# EAGLE design USB&LiPoPower (EAGLE 9.5.1)
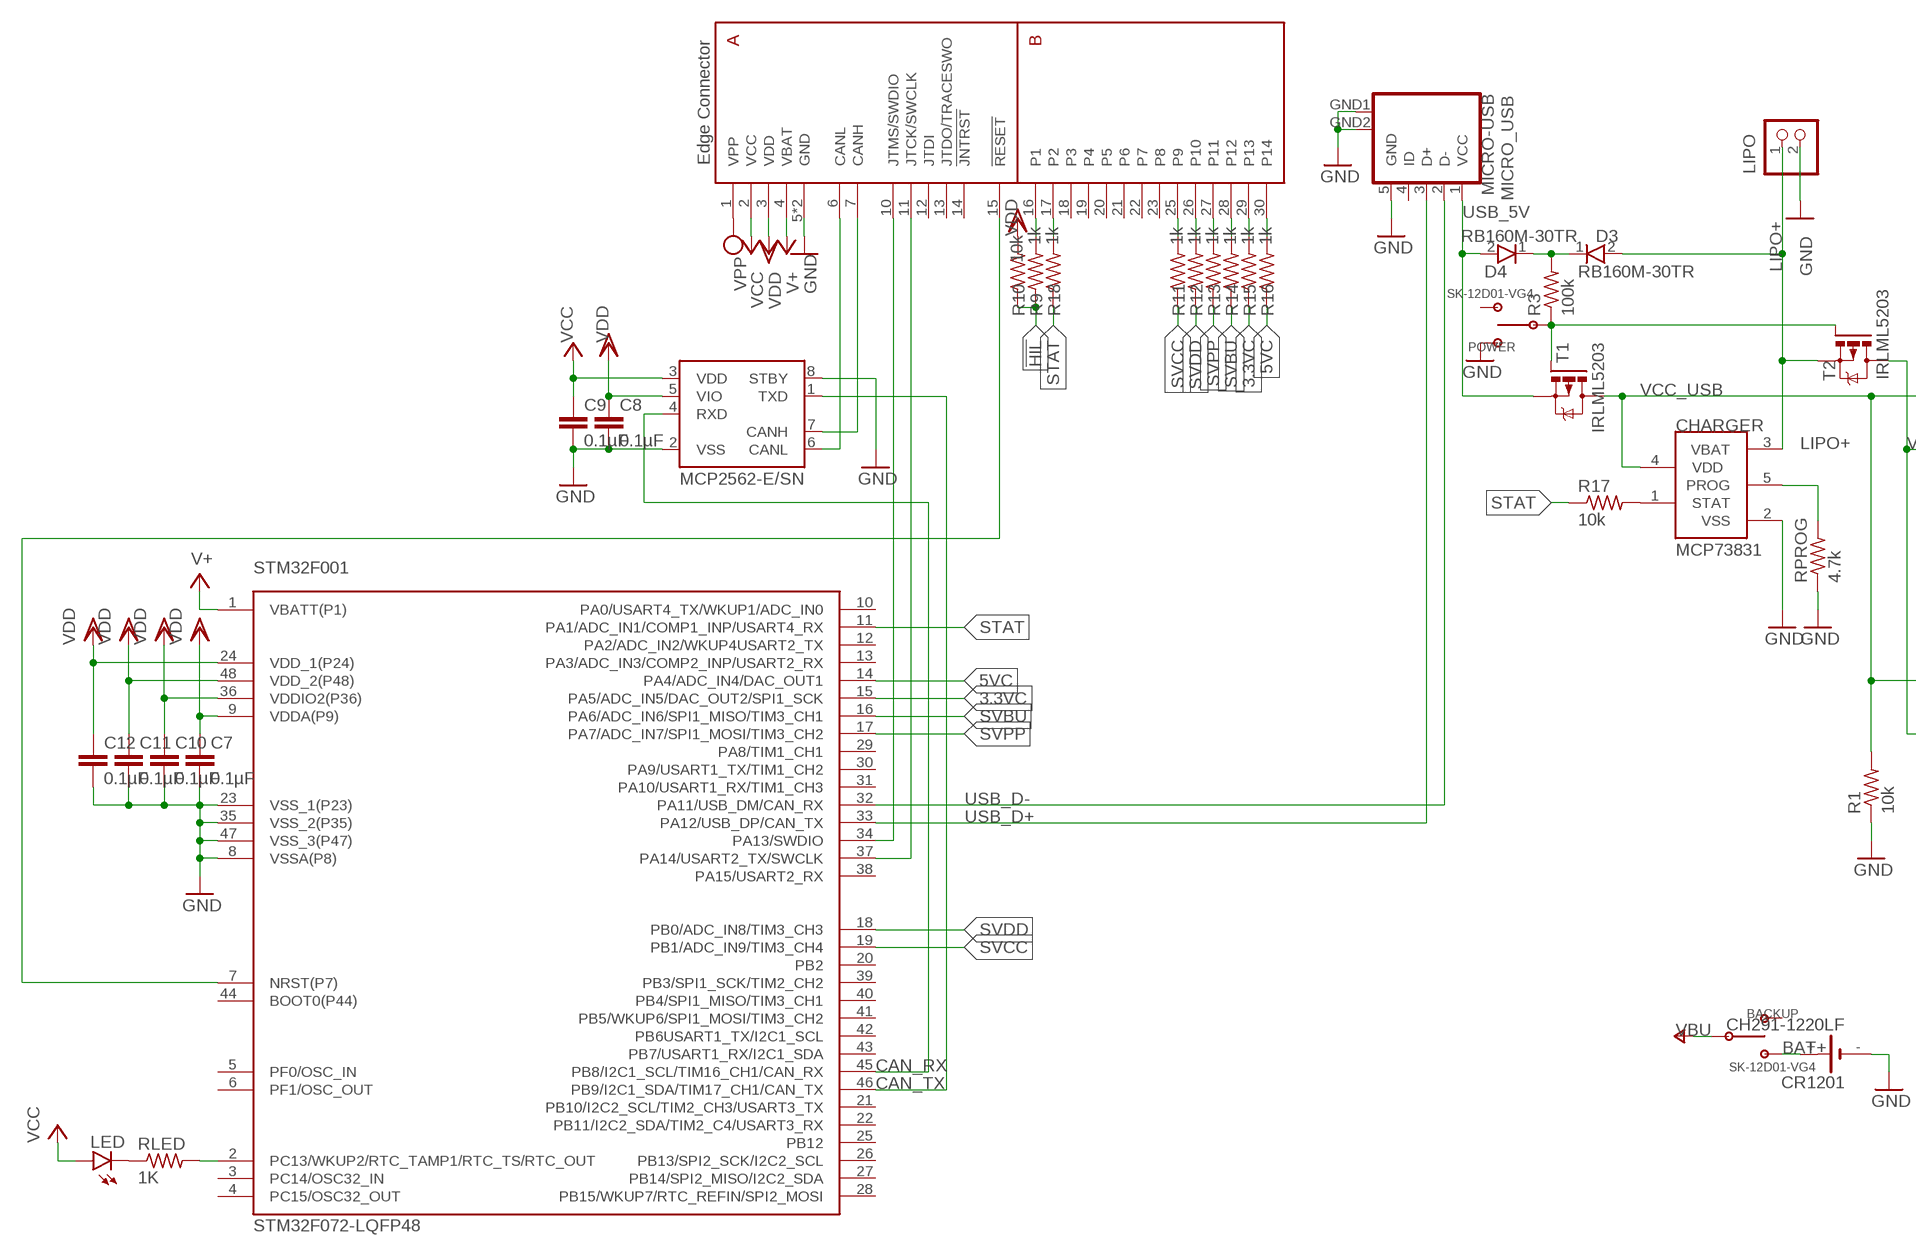
[diagram p0: schematic, sheet 1, part 1 of 2]
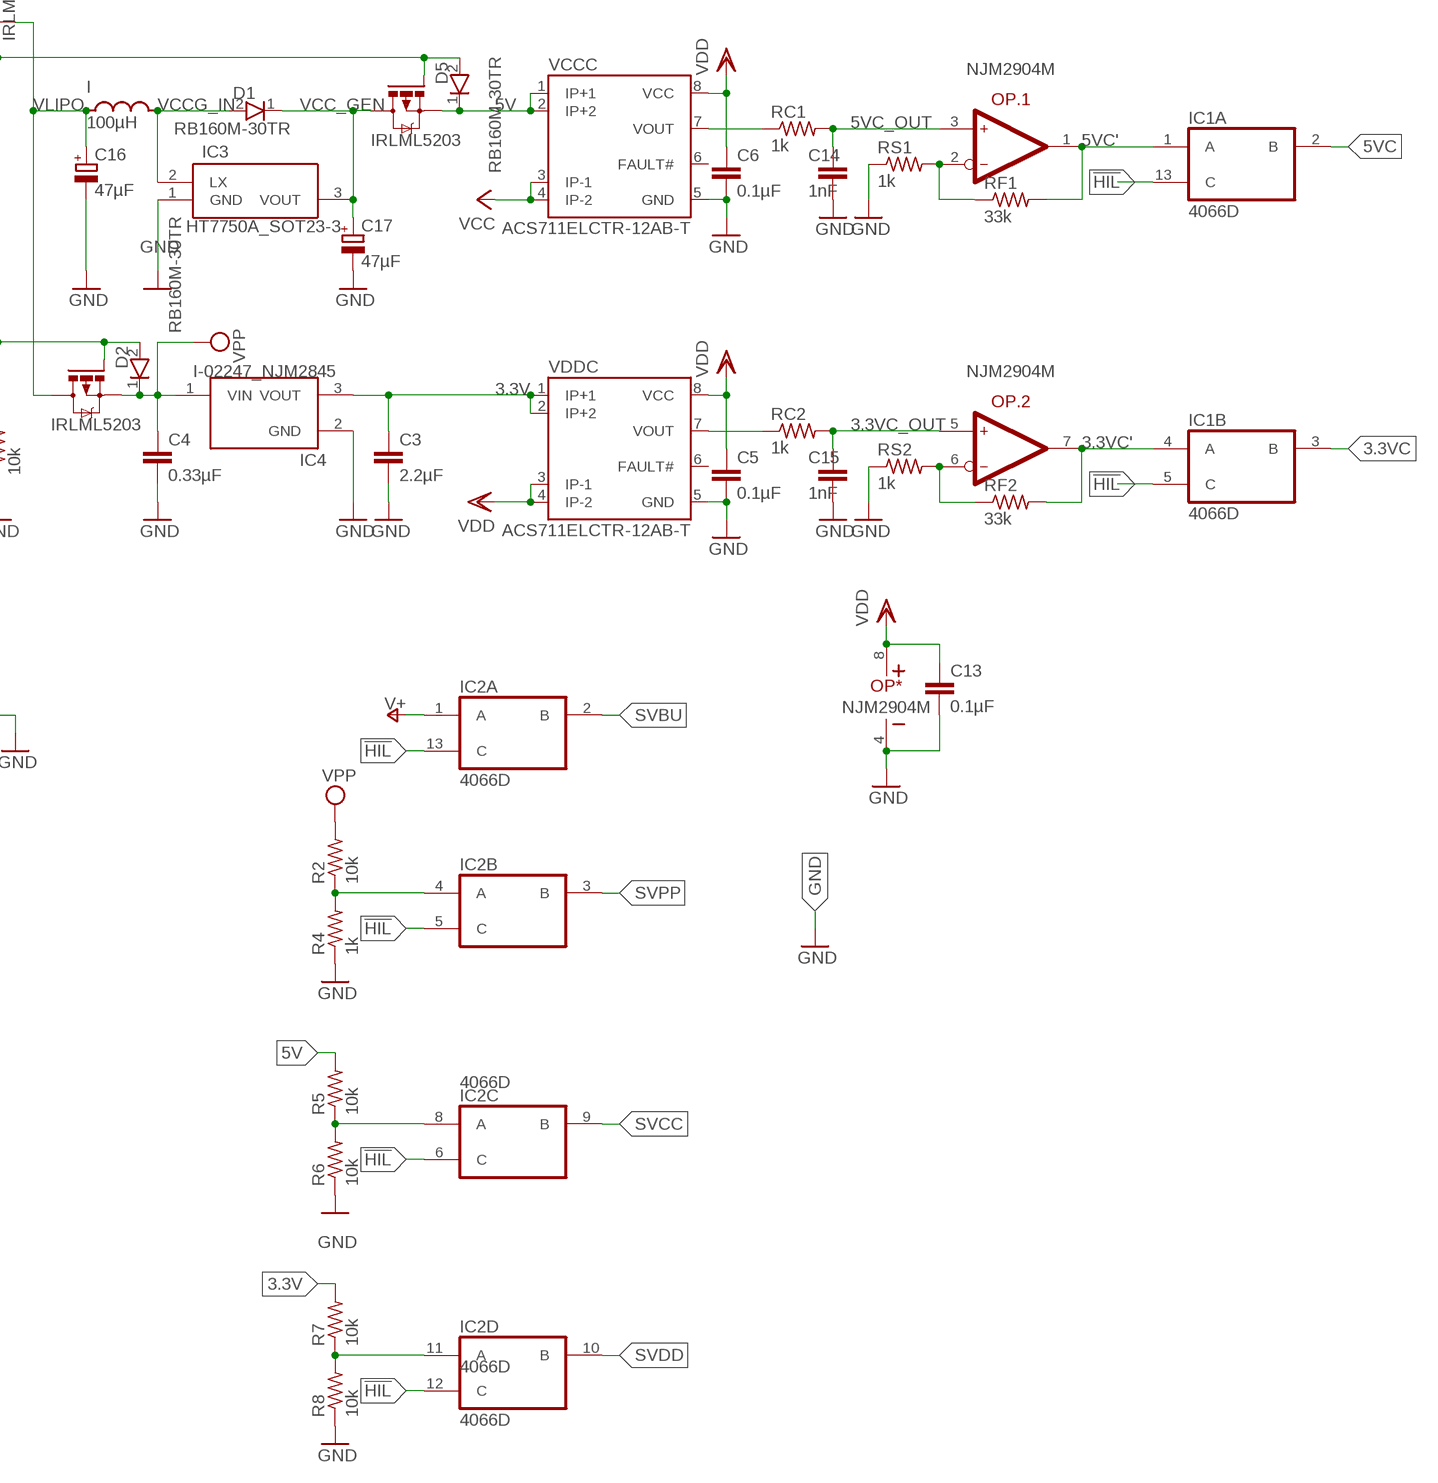
[diagram p1: schematic, sheet 1, part 2 of 2]

## Parts
BACKUP  SK-12D01-VG4  [SK-12D01-VG4]
C3  2.2µF  C-EUC0603K  [C0603K]
C4  0.33µF  C-EUC0603K  [C0603K]
C5  0.1µF  C-EUC0603K  [C0603K]
C6  0.1µF  C-EUC0603K  [C0603K]
C7  0.1µF  C-EUC0603K  [C0603K]
C8  0.1µF  C-EUC0603K  [C0603K]
C9  0.1µF  C-EUC0603K  [C0603K]
C10  0.1µF  C-EUC0603K  [C0603K]
C11  0.1µF  C-EUC0603K  [C0603K]
C12  0.1µF  C-EUC0603K  [C0603K]
C13  0.1µF  C-EUC0603K  [C0603K]
C14  1nF  C-EUC0603K  [C0603K]
C15  1nF  C-EUC0603K  [C0603K]
C16  47µF  CPOL-EUUD-5X5,8  [UD-5X5,8_NICHICON]
C17  47µF  CPOL-EUUD-5X5,8  [UD-5X5,8_NICHICON]
CHARGER  MCP73831  [SOT23-5L]
CR1201  CH291-1220LF  [CH291-1220LF]
D1  RB160M-30TR  [SODFL3516X90N]
D2  RB160M-30TR  [SODFL3516X90N]
D3  RB160M-30TR  [SODFL3516X90N]
D4  RB160M-30TR  [SODFL3516X90N]
D5  RB160M-30TR  [SODFL3516X90N]
I  100µH  NR10050  [NR10050]
IC1  4066D  [SO14]
IC2  4066D  [SO14]
IC3  HT7750A_SOT23-3  [SOT95P190X145-3N]
IC4  I-02247_NJM2845  [TO252]
LED  LEDCHIP-LED0603  [CHIP-LED0603]
LIPO  S2B-PH-K-S  [S2B-PH-K-S]
MCP2562  MCP2562-E/SN  [SOIC127P600X175-8N]
MICRO_USB  MICRO-USB  [MICRO-USB]
OP  NJM2904M  [SO-8]
POWER  SK-12D01-VG4  [SK-12D01-VG4]
R1  10k  R-US_R0603  [R0603]
R2  10k  R-US_R0603  [R0603]
R3  100k  R-US_R0603  [R0603]
R4  1k  R-US_R0603  [R0603]
R5  10k  R-US_R0603  [R0603]
R6  10k  R-US_R0603  [R0603]
R7  10k  R-US_R0603  [R0603]
R8  10k  R-US_R0603  [R0603]
R9  1k  R-US_R0603  [R0603]
R10  10k  R-US_R0603  [R0603]
R11  1k  R-US_R0603  [R0603]
R12  1k  R-US_R0603  [R0603]
R13  1k  R-US_R0603  [R0603]
R14  1k  R-US_R0603  [R0603]
R15  1k  R-US_R0603  [R0603]
R16  1k  R-US_R0603  [R0603]
R17  10k  R-US_R0603  [R0603]
R18  1k  R-US_R0603  [R0603]
RC1  1k  R-US_R0603  [R0603]
RC2  1k  R-US_R0603  [R0603]
RF1  33k  R-US_R0603  [R0603]
RF2  33k  R-US_R0603  [R0603]
RLED  1K  R-US_R0603  [R0603]
RPROG  4.7k  R-US_R0603  [R0603]
RS1  1k  R-US_R0603  [R0603]
RS2  1k  R-US_R0603  [R0603]
STM32F001  STM32F072-LQFP48  [LQFP48]
T1  IRLML5203  [MICRO3]
T2  IRLML5203  [MICRO3]
T3  IRLML5203  [MICRO3]
T4  IRLML5203  [MICRO3]
U$2  EDGE30  [EDGE30]
VCCC  ACS711ELCTR-12AB-T  [SOIC8]
VDDC  ACS711ELCTR-12AB-T  [SOIC8]

## Nets
3.3V: C3.1 IC4.3(VOUT) R7.2 VDDC.1(IP+1) VDDC.2(IP+2)
3.3VC: IC1.3(B:B) R15.1 STM32F001.15(PA5/ADC_IN5/DAC_OUT2/SPI1_SCK)
3.3VC': IC1.4(B:A) OP.7(.2:OUT) RF2.2
3.3VC_OUT: C15.1 OP.5(.2:IN+) RC2.2
3.3VC_OUT': RC2.1 VDDC.7(VOUT)
5V: D5.1(K) R5.2 T3.2(S) VCCC.1(IP+1) VCCC.2(IP+2)
5VC: IC1.2(A:B) R16.1 STM32F001.14(PA4/ADC_IN4/DAC_OUT1)
5VC': IC1.1(A:A) OP.1(.1:OUT) RF1.2
5VC_OUT: C14.1 OP.3(.1:IN+) RC1.2
5VC_OUT': RC1.1 VCCC.7(VOUT)
!HIL!: IC1.5(B:C) IC1.13(A:C) IC2.5(B:C) IC2.6(C:C) IC2.12(D:C) IC2.13(A:C) R9.1 R10.1
BAT+: BACKUP.B CR1201.+
CAN_RX: MCP2562.4(RXD) STM32F001.45(PB8/I2C1_SCL/TIM16_CH1/CAN_RX)
CAN_TX: MCP2562.1(TXD) STM32F001.46(PB9/I2C1_SDA/TIM17_CH1/CAN_TX)
CANH1: MCP2562.7(CANH) U$2.7(CANH)
CANL1: MCP2562.6(CANL) U$2.6(CANL)
GND: C3.2 C4.2 C5.2 C6.2 C7.2 C8.2 C9.2 C10.2 C11.2 C12.2 C13.2 C14.2 C15.2 C16.- C17.- CHARGER.2(VSS) CR1201.- IC3.1(GND) IC4.2(GND) LIPO.2 MCP2562.2(VSS) MCP2562.8(STBY) MICRO_USB.5(GND) MICRO_USB.GND1(GND) MICRO_USB.GND2(GND) OP.4(*:V-) POWER.A R1.1 R4.1 R6.1 R8.1 RPROG.1 RS1.1 RS2.1 STM32F001.8(VSSA(P8)) STM32F001.23(VSS_1(P23)) STM32F001.35(VSS_2(P35)) STM32F001.47(VSS_3(P47)) U$2.5(GND) U$2.8(GND) VCCC.5(GND) VDDC.5(GND)
LIPO+: CHARGER.3(VBAT) D3.2(A) LIPO.1 T2.2(S)
N$1: CHARGER.5(PROG) RPROG.2
N$2: CHARGER.1(STAT) R17.2
N$3: LED.C RLED.1
N$5: OP.2(.1:IN-) RF1.1 RS1.2
N$6: OP.6(.2:IN-) RF2.1 RS2.2
N$9: POWER.C R3.1 T1.1(G) T2.1(G)
N$10: D3.1(K) D4.1(K) R3.2
N$33: R16.2 U$2.30(P14)
N$34: R15.2 U$2.29(P13)
N$35: R14.2 U$2.28(P12)
N$36: R13.2 U$2.27(P11)
N$43: R12.2 U$2.26(P10)
N$44: R11.2 U$2.25(P9)
N$73: RLED.2 STM32F001.2(PC13/WKUP2/RTC_TAMP1/RTC_TS/RTC_OUT)
N$74: R9.2 U$2.16(P1)
N$75: R18.2 U$2.17(P2)
NRST1: STM32F001.7(NRST(P7)) U$2.15(!RESET!)
PVCC: IC2.8(C:A) R5.1 R6.2
PVDD: IC2.11(D:A) R7.1 R8.2
PVPP: IC2.4(B:A) R2.1 R4.2
STAT: R17.1 R18.1 STM32F001.11(PA1/ADC_IN1/COMP1_INP/USART4_RX)
SVBU: IC2.2(A:B) R14.1 STM32F001.16(PA6/ADC_IN6/SPI1_MISO/TIM3_CH1)
SVCC: IC2.9(C:B) R11.1 STM32F001.19(PB1/ADC_IN9/TIM3_CH4)
SVDD: IC2.10(D:B) R12.1 STM32F001.18(PB0/ADC_IN8/TIM3_CH3)
SVPP: IC2.3(B:B) R13.1 STM32F001.17(PA7/ADC_IN7/SPI1_MOSI/TIM3_CH2)
SWCLK1: STM32F001.37(PA14/USART2_TX/SWCLK) U$2.11(JTCK/SWCLK)
SWDIO1: STM32F001.34(PA13/SWDIO) U$2.10(JTMS/SWDIO)
USB_5V: D4.2(A) MICRO_USB.1(VCC) T1.2(S)
USB_D+: MICRO_USB.3(D+) STM32F001.33(PA12/USB_DP/CAN_TX)
USB_D-: MICRO_USB.2(D-) STM32F001.32(PA11/USB_DM/CAN_RX)
VBU: BACKUP.C IC2.1(A:A) STM32F001.1(VBATT(P1)) U$2.4(VBAT) ; supply symbol labelled V+
VCC: C9.1 LED.A MCP2562.3(VDD) U$2.2(VCC) VCCC.3(IP-1) VCCC.4(IP-2)
VCC_GEN: C17.+ D1.1(K) IC3.3(VOUT) T3.3(D)
VCC_USB: CHARGER.4(VDD) D2.2(A) D5.2(A) R1.2 T1.3(D) T3.1(G) T4.1(G)
VCCG_IN: D1.2(A) I.2 IC3.2(LX)
VDD: C5.1 C6.1 C7.1 C8.1 C10.1 C11.1 C12.1 C13.1 MCP2562.5(VIO) OP.8(*:V+) R10.2 STM32F001.9(VDDA(P9)) STM32F001.24(VDD_1(P24)) STM32F001.36(VDDIO2(P36)) STM32F001.48(VDD_2(P48)) U$2.3(VDD) VCCC.8(VCC) VDDC.3(IP-1) VDDC.4(IP-2) VDDC.8(VCC)
VLIPO: C16.+ I.1 T2.3(D) T4.3(D)
VPP: C4.1 D2.1(K) IC4.1(VIN) R2.2 T4.2(S) U$2.1(VPP)
Unconnected: BACKUP.A IC1.6(C:C) IC1.8(C:A) IC1.9(C:B) IC1.10(D:B) IC1.11(D:A) IC1.12(D:C) MICRO_USB.4(ID) POWER.B STM32F001.3(PC14/OSC32_IN) STM32F001.4(PC15/OSC32_OUT) STM32F001.5(PF0/OSC_IN) STM32F001.6(PF1/OSC_OUT) STM32F001.10(PA0/USART4_TX/WKUP1/ADC_IN0) STM32F001.12(PA2/ADC_IN2/WKUP4USART2_TX) STM32F001.13(PA3/ADC_IN3/COMP2_INP/USART2_RX) STM32F001.20(PB2) STM32F001.21(PB10/I2C2_SCL/TIM2_CH3/USART3_TX) STM32F001.22(PB11/I2C2_SDA/TIM2_C4/USART3_RX) STM32F001.25(PB12) STM32F001.26(PB13/SPI2_SCK/I2C2_SCL) STM32F001.27(PB14/SPI2_MISO/I2C2_SDA) STM32F001.28(PB15/WKUP7/RTC_REFIN/SPI2_MOSI) STM32F001.29(PA8/TIM1_CH1) STM32F001.30(PA9/USART1_TX/TIM1_CH2) STM32F001.31(PA10/USART1_RX/TIM1_CH3) STM32F001.38(PA15/USART2_RX) STM32F001.39(PB3/SPI1_SCK/TIM2_CH2) STM32F001.40(PB4/SPI1_MISO/TIM3_CH1) STM32F001.41(PB5/WKUP6/SPI1_MOSI/TIM3_CH2) STM32F001.42(PB6USART1_TX/I2C1_SCL) STM32F001.43(PB7/USART1_RX/I2C1_SDA) STM32F001.44(BOOT0(P44)) U$2.12(JTDI) U$2.13(JTDO/TRACESWO) U$2.14(!JNTRST!) U$2.18(P3) U$2.19(P4) U$2.20(P5) U$2.21(P6) U$2.22(P7) U$2.23(P8) VCCC.6(FAULT#) VDDC.6(FAULT#)

## Power pins joined to a net without a drawn wire
GND: IC1.7(P:VSS) IC2.7(P:VSS)
VDD: IC1.14(P:VDD) IC2.14(P:VDD)

## Library data of the parts
BACKUP POWER = switches:SK-12D01-VG4
C3-C15 = rcl:C-EU: CAPACITOR, European symbol; SPICEPREFIX: C
C16 C17 = rcl:CPOL-EU: POLARIZED CAPACITOR, European symbol; SPICEPREFIX: C
CHARGER = mcp73831:MCP73831: Miniature Single-Cell, Fully Integrated Li-Ion, Li-Polymer Charge Management Controllers
CR1201 = battery:CH291-1220LF: Battery Holder, SMT, 12mm multicomp PART NO. CH291-1220LF Source: Data sheet <http://www.farnell.com/datasheets/1505860.pdf>
D1-D5 = RB160M-30TR:RB160M-30TR: ROHM - RB160M-30TR - DIODE, SCHOTTKY, PMDS Source: Datasheet <https://componentsearchengine.com/Datasheets/2/RB160M-30TR.pdf>; DESCRIPTION: ROHM - RB160M-30TR - DIODE, SCHOTTKY, PMDS; HEIGHT: 0.9mm; MANUFACTURER_NAME: ROHM Semiconductor; MANUFACTURER_PART_NUMBER: RB160M-30TR; MOUSER_PART_NUMBER: 755-RB160M-30TR; MOUSER_PRICE-STOCK: https://www.mouser.com/Search/Refine.aspx?Keyword=755-RB160M-30TR; RS_PART_NUMBER: 7526079; RS_PRICE-STOCK: https://uk.rs-online.com/web/p/products/7526079
I = nr10050:NR10050
IC1 IC2 = 40xx:4066: Quad bilateral ANALOG SWITCH
IC3 = HT7750A_SOT23-3:HT7750A_SOT23-3: PFM Step-up DC/DC Converter Source: Datasheet <http://www.holtek.com.tw/documents/10179/11842/HT77xxAv140.pdf#search='HT7750A SOT23'>; DESCRIPTION: PFM Step-up DC/DC Converter; HEIGHT: 1.45mm; MANUFACTURER_NAME: Holtek; MANUFACTURER_PART_NUMBER: HT7750A SOT23-3
IC4 = akizuki:I-02247_NJM2845
LED = led:LED: LED OSRAM: - CHIPLED LG R971, LG N971, LY N971, LG Q971, LY Q971, LO R971, LY R971 LH N974, LH R974 LS Q976, LO Q976, LY Q976 LO Q996 - Hyper CHIPLED LW Q18S LB Q993, LB Q99A, LB R99A - SideLED LS A670, LO A670, LY A670, LG A670, LP A670 LB A673, LV A673, LT A673, LW A673 LH A674 LY A675 LS A676, LA A676, LO A676, LY A676, LW A676 LS A679, LY A679, LG A679 - Hyper Micro SIDELED® LS Y876, LA Y876, LO Y876, LY Y876 LT Y87S - SmartLED LW L88C, LW L88S LB L89C, LB L89S, LG L890 LS L89K, LO L89K, LY L89K LS L896, LA L896, LO L896, LY L896 - TOPLED LS T670, LO T670, LY T670, LG T670, LP T670 LSG T670, LSP T670, LSY T670, LOP T670, LYG T670 LG T671, LOG T671, LSG T671 LB T673, LV T673, LT T673, LW T673 LH T674 LS T676, LA T676, LO T676, LY T676, LB T676, LH T676, LSB T676, LW T676 LB T67C, LV T67C, LT T67C, LS T67K, LO T67K, LY T67K, LW E67C LS E67B, LA E67B, LO E67B, LY E67B, LB E67C, LV E67C, LT E67C LW T67C LS T679, LY T679, LG T679 LS T770, LO T770, LY T770, LG T770, LP T770 LB T773, LV T773, LT T773, LW T773 LH T774 LS E675, LA E675, LY E675, LS T675 LS T776, LA T776, LO T776, LY T776, LB T776 LHGB T686 LT T68C, LB T68C - Hyper Mini TOPLED® LB M676 - Mini TOPLED Santana® LG M470 LS M47K, LO M47K, LY M47K Source: http://www.osram.convergy.de LUXEON: - LUMILED® LXK2-PW12-R00, LXK2-PW12-S00, LXK2-PW14-U00, LXK2-PW14-V00 LXK2-PM12-R00, LXK2-PM12-S00, LXK2-PM14-U00 LXK2-PE12-Q00, LXK2-PE12-R00, LXK2-PE12-S00, LXK2-PE14-T00, LXK2-PE14-U00 LXK2-PB12-K00, LXK2-PB12-L00, LXK2-PB12-M00, LXK2-PB14-N00, LXK2-PB14-P00, LXK2-PB14-Q00 LXK2-PR12-L00, LXK2-PR12-M00, LXK2-PR14-Q00, LXK2-PR14-R00 LXK2-PD12-Q00, LXK2-PD12-R00, LXK2-PD12-S00 LXK2-PH12-R00, LXK2-PH12-S00 LXK2-PL12-P00, LXK2-PL12-Q00, LXK2-PL12-R00 Source: www.luxeon.com KINGBRIGHT: KA-3528ASYC Source: www.kingbright.com
LIPO = jst-ph:S2B-PH-*: Wire-to-Board 2.0mm pitch side mount connector Source: http://www.jst-mfg.com/product/pdf/jpn/PH.pdf http://www.jst-mfg.com/product/detail.php?series=199
MCP2562 = mcp2562-E_SN:MCP2562-E/SN: MCP2562 Series 5 V Surface Mount High-Speed CAN Transceiver - SOIC-8; AVAILABILITY: Unavailable; DESCRIPTION: Microchip MCP2562-E/SN, CAN Transceiver 1MBps 1-channel IEC 61000-4-2, 8-Pin SOIC; MF: Microchip; MP: MCP2562-E/SN; PACKAGE: SO-8 Microchip; PRICE: None
MICRO_USB = microusb2:MICRO-USB: Micro USB B connector
OP = ic-jrc:NJM2904; MOUSER: 513-NJM2904M
R1-R8 RC1 RC2 RF1 RF2 RLED RPROG RS1 RS2 = rcl:R-US_: RESISTOR, American symbol; SPICEPREFIX: R
R9-R18 = resistor:R-US_: RESISTOR, American symbol
STM32F001 = stm32f0:STM32F072
T1-T4 = transistor-power:IRLML5203: HEXFET P-Channel Power MOSFET
U$2 = bus:EDGE30
VCCC VDDC = allegro:ACS711E: SENSOR CURRENT 3.3V 8-SOIC tested: YES (etherbotix); CURRENT: 12.5A

## Board
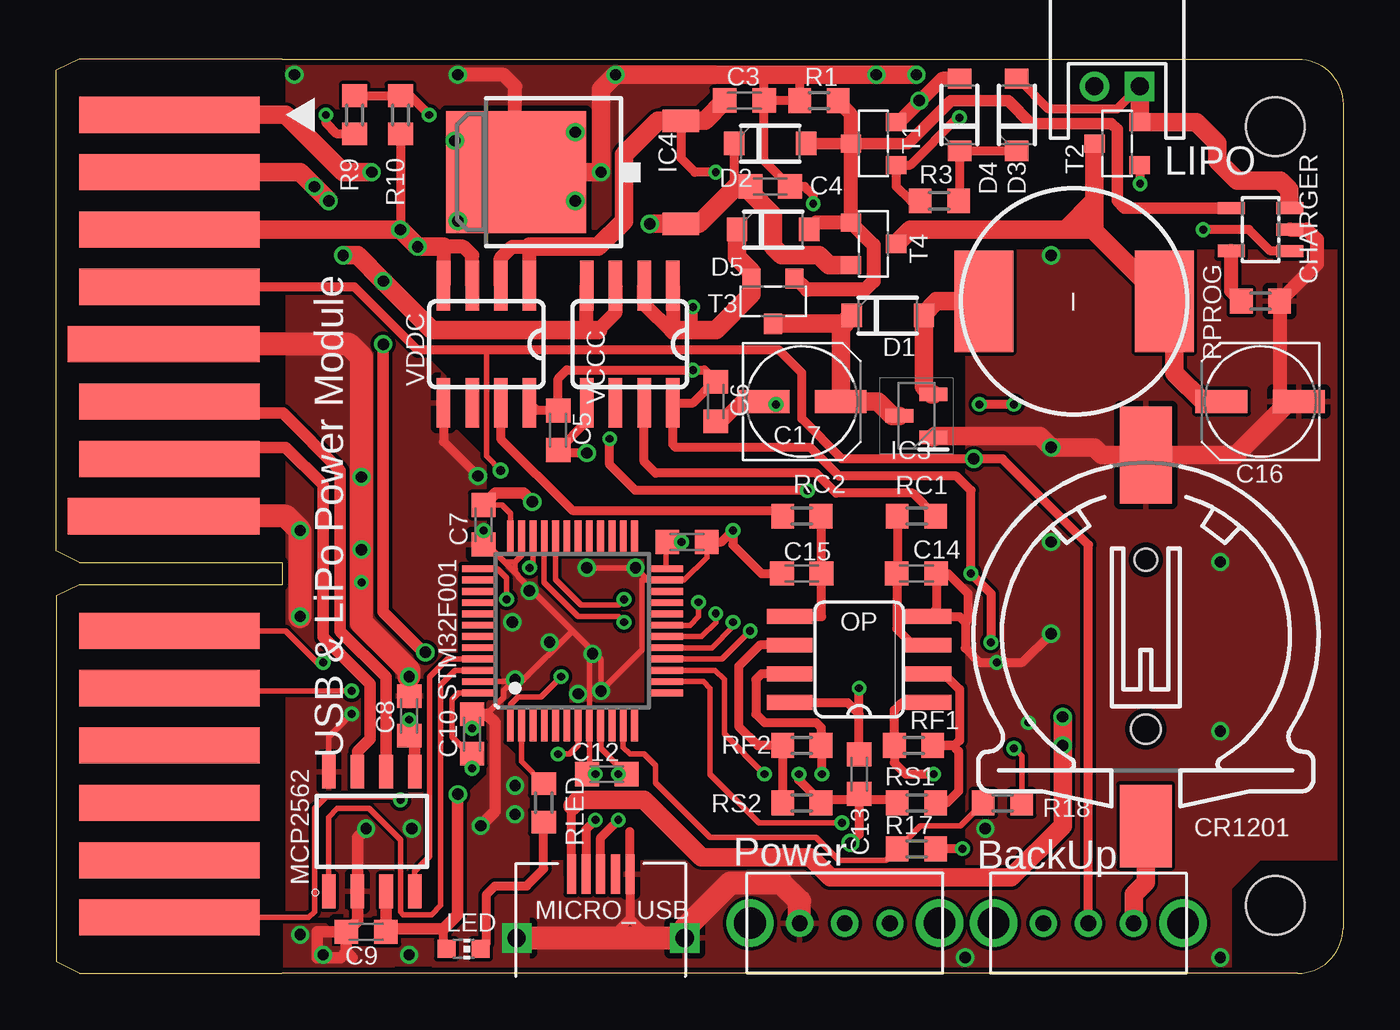
[diagram p2: board, top side]
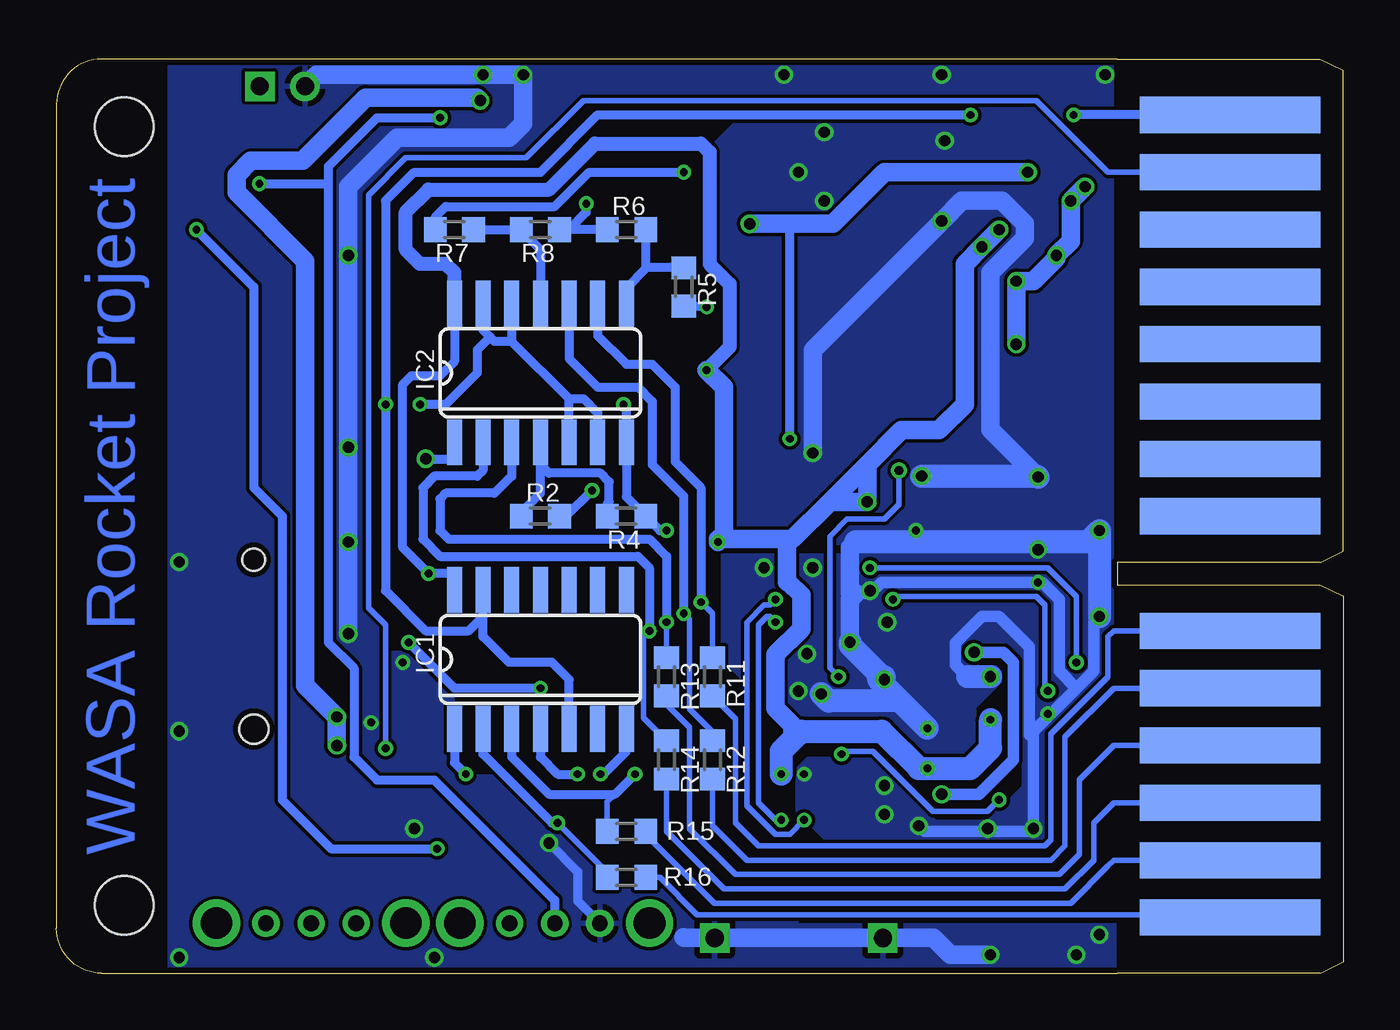
[diagram p3: board, bottom side, seen from below]

Size 57 x 40.5 mm. Coordinates in mm from the lower left corner, seen from the top.
Outline: 10,40.5 55,40.5 arc-90 57,38.5 57,2 arc-90 55,0 10,0
Copper layers (1*16): Top 0.035mm / dielectric 1.5mm / Bottom 0.035mm
Design rules "SeeedStudio_2layer_DRU_no_angle_20140221": minimum track width 6mil, minimum drill 12mil, track to track 6mil, track to pad 6mil, pad to pad 6mil, via to via 6mil, smd to smd 0mil, copper to edge 10mil, drill to drill 10mil, minimum pad ring 10mil, minimum via ring 6mil, stop-mask expansion 2mil, vias tented up to drill 100mil, thermal gap 10mil
Holes 2.6 mm at 54,3 54,37.5

### Footprints (pad centres in the part's own frame; a part is rotated, then mirrored left to right if it is on the bottom)
SK-12D01-VG4 = drill 1.4 pad 1.93: 1 -4.2,0; 2 4.2,0 | drill 0.7: A -2,0; B 2,0; C 0,0
C0603K = smd 1.05 x 1.08: 1 -0.875,0; 2 0.875,0
UD-5X5,8_NICHICON = smd 2.3 x 1: + 1.725,0; - -1.7,0
SOT23-5L = smd 0.533 x 1.2: 1 -0.95,-1.3; 2 0,-1.3; 3 0.95,-1.3 | smd 0.55 x 1.2: 4 0.95,1.3; 5 -0.95,1.3
CH291-1220LF = smd 2.3 x 3.66: + 0,-2.296 | smd 2.3 x 4.3: - 0,14.146 | hole 1.3: 0,2 | hole 1: 0,9.5
SODFL3516X90N = smd 0.9 x 1.04: 1 -1.6,0; 2 1.6,0
NR10050 = smd 2.6 x 4.5: 1 -4,0; 2 4,0
SO14 = smd 0.66 x 2.032: 1 -3.81,-3.073; 2 -2.54,-3.073; 3 -1.27,-3.073; 4 0,-3.073; 5 1.27,-3.073; 6 2.54,-3.073; 7 3.81,-3.073; 8 3.81,3.073; 9 2.54,3.073; 10 1.27,3.073; 11 0,3.073; 12 -1.27,3.073; 13 -2.54,3.073; 14 -3.81,3.073
SOT95P190X145-3N = smd 1.25 x 0.6: 1 -0.75,0.95; 2 -0.75,-0.95; 3 0.75,0
TO252 = smd 1 x 1.6: 1 -2.28,-4.8; 3 2.28,-4.8 | smd 5.4 x 6.2: 2 0,2.5
CHIP-LED0603 = smd 0.8 x 0.8: A 0,-0.75; C 0,0.75
S2B-PH-K-S = drill 0.8 square: 1 1,0 | drill 0.8: 2 -1,0
SOIC127P600X175-8N = smd 1.5 x 0.6: 1 -2.65,1.905; 2 -2.65,0.635; 3 -2.65,-0.635; 4 -2.65,-1.905; 5 2.65,-1.905; 6 2.65,-0.635; 7 2.65,0.635; 8 2.65,1.905
MICRO-USB = smd 0.4 x 1.75: 1 -1.3,4.525; 2 -0.65,4.525; 3 0,4.525; 4 0.65,4.525; 5 1.3,4.525 | drill 0.8 pad 1.27 square: GND1 -3.725,1.7; GND2 3.725,1.7
SO-8 = smd 0.66 x 2.032: 1 -1.905,-3.073; 2 -0.635,-3.073; 3 0.635,-3.073; 4 1.905,-3.073; 5 1.905,3.073; 6 0.635,3.073; 7 -0.635,3.073; 8 -1.905,3.073
R0603 = smd 1 x 1.1: 1 -0.85,0; 2 0.85,0
LQFP48 = smd 1.5 x 0.3: 1 -4.15,2.75; 2 -4.15,2.25; 3 -4.15,1.75; 4 -4.15,1.25; 5 -4.15,0.75; 6 -4.15,0.25; 7 -4.15,-0.25; 8 -4.15,-0.75; 9 -4.15,-1.25; 10 -4.15,-1.75; 11 -4.15,-2.25; 12 -4.15,-2.75; 25 4.15,-2.75; 26 4.15,-2.25; 27 4.15,-1.75; 28 4.15,-1.25; 29 4.15,-0.75; 30 4.15,-0.25; 31 4.15,0.25; 32 4.15,0.75; 33 4.15,1.25; 34 4.15,1.75; 35 4.15,2.25; 36 4.15,2.75 | smd 0.3 x 1.5: 13 -2.75,-4.15; 14 -2.25,-4.15; 15 -1.75,-4.15; 16 -1.25,-4.15; 17 -0.75,-4.15; 18 -0.25,-4.15; 19 0.25,-4.15; 20 0.75,-4.15; 21 1.25,-4.15; 22 1.75,-4.15; 23 2.25,-4.15; 24 2.75,-4.15; 37 2.75,4.15; 38 2.25,4.15; 39 1.75,4.15; 40 1.25,4.15; 41 0.75,4.15; 42 0.25,4.15; 43 -0.25,4.15; 44 -0.75,4.15; 45 -1.25,4.15; 46 -1.75,4.15; 47 -2.25,4.15; 48 -2.75,4.15
MICRO3 = smd 0.8 x 0.9: 1 -0.95,-1; 2 0.95,-1; 3 0,1
EDGE30 = smd 1.6 x 8: 1 -17.78,-5; 2 -15.24,-5; 3 -12.7,-5; 4 -10.16,-5; 6 -5.08,-5; 7 -2.54,-5; 10 5.08,-5; 11 7.62,-5; 12 10.16,-5; 13 12.7,-5; 14 15.24,-5; 15 17.78,-5 | smd 1.6 x 8.5: 5 -7.62,-5.25; 8 0,-5.25 | smd 1.6 x 8 bottom: 16 -17.78,-5; 17 -15.24,-5; 18 -12.7,-5; 19 -10.16,-5; 20 -7.62,-5; 21 -5.08,-5; 22 -2.54,-5; 23 0,-5; 25 5.08,-5; 26 7.62,-5; 27 10.16,-5; 28 12.7,-5; 29 15.24,-5; 30 17.78,-5
SOIC8 = smd 0.6 x 2.2: 1 -1.905,-2.6; 2 -0.635,-2.6; 3 0.635,-2.6; 4 1.905,-2.6; 5 1.905,2.6; 6 0.635,2.6; 7 -0.635,2.6; 8 -1.905,2.6

### Placement (x,y rotation side)
BACKUP  45.72,2.22 0 top
C3  30.48,38.66 0 top
C4  31.62,34.86 0 top
C5  22.23,24.06 270 top
C6  29.21,25.33 270 top
C7  18.92,19.87 270 top
C8  15.63,11.41 90 top
C9  13.72,1.84 180 top
C10  18.41,10.6 90 top
C11  27.94,19.11 0 top
C12  24.38,8.82 180 top
C13  35.56,8.82 270 top
C14  38.1,17.71 0 top
C15  33.02,17.71 180 top
C16  53.34,25.33 180 top
C17  33.02,25.33 0 top
CHARGER  53.34,32.95 90 top
CR1201  48.26,8.82 0 top
D1  36.83,29.14 0 top
D2  31.62,36.76 0 top
D3  42.55,38.03 90 top
D4  40.01,38.03 90 top
D5  31.75,32.95 0 top
I  45.09,29.77 180 top
IC1  35.56,13.9 0 bottom
IC2  35.56,26.6 0 bottom
IC3  38.1,24.7 180 top
IC4  22.86,35.49 90 top
LED  18.03,1.07 270 top
LIPO  46.99,39.3 0 top
MCP2562  13.97,6.28 90 top
MICRO_USB  24.11,-0.14 0 top
OP  35.56,13.9 90 top
POWER  34.92,2.22 0 top
R1  33.78,38.66 0 top
R2  35.56,20.25 0 bottom
R3  39.12,34.22 0 top
R4  31.75,20.25 180 bottom
R5  29.21,30.41 270 bottom
R6  31.75,32.95 0 bottom
R7  39.37,32.95 180 bottom
R8  35.56,32.95 180 bottom
R9  13.21,38.03 270 top
R10  15.24,38.03 270 top
R11  27.94,13.14 270 bottom
R12  27.94,9.46 270 bottom
R13  29.97,13.14 270 bottom
R14  29.97,9.46 270 bottom
R15  31.75,6.28 0 bottom
R16  31.75,4.25 0 bottom
R17  38.1,5.52 0 top
R18  41.91,7.55 0 top
RC1  38.1,20.25 180 top
RC2  33.02,20.25 0 top
RF1  37.97,10.09 180 top
RF2  33.02,10.09 0 top
RLED  21.59,7.55 90 top
RPROG  53.34,29.77 180 top
RS1  38.1,7.55 0 top
RS2  33.02,7.55 180 top
STM32F001  22.86,15.17 90 top
T1  36.2,36.76 90 top
T2  46.99,36.76 90 top
T3  31.75,29.77 180 top
T4  36.2,32.31 270 top
U$2  10,20.25 270 top
VCCC  25.4,27.87 180 top
VDDC  19.05,27.87 180 top

### Tracks (layer width: path | path; a pad name or v marks a point on that pad's centre or on a via)
3.3V  (via drill 0.35)
  Top 0.406: v29.21,35.49 28.29,35.49 27.66,36.12 IC4.3
  Top 0.61: VDDC.2 19.68,31.68 20.19,32.19 20.95,32.19 VDDC.1
  Top 0.813: C3.1 28.73,37.77 IC4.3 26.64,37.77 25.15,36.27 25.15,33.33 24,32.19 20.95,32.19
  Bottom 0.406: R7.2 40.22,33.5 39.75,33.97 34.92,33.97 33.4,35.49 v29.21,35.49
3.3VC  (via drill 0.35)
  Top 0.254: STM32F001.15 29.18,13.42 29.59,13.01 29.59,10.6 v31.37,8.82
  Bottom 0.254: R15.1 32.6,7.59 32.26,7.93
  Bottom 0.406: IC1.3 36.83,9.58 35.18,7.93 32.26,7.93 v31.37,8.82
3.3VC'  (via drill 0.35)
  Top 0.406: OP.7 31.24,13.27 30.99,13.01 30.99,11.49 31.37,11.11 33.66,11.11 33.87,10.89 RF2.2 33.91,10.05 v33.91,8.82
  Bottom 0.406: IC1.4 35.56,9.58 34.8,8.82 v33.91,8.82
3.3VC_OUT
  Top 0.406: RC2.2 33.87,17.73 C15.1 33.9,15.8 OP.5
3.3VC_OUT'
  Top 0.406: VDDC.7 19.68,23.68 22.86,20.5 31.92,20.5 RC2.1
5V  (via drill 0.35)
  Top 0.406: v28.19,29.52 28.19,28.76 27.94,28.51
  Top 0.61: VCCC.1 27.3,28.51 27.3,28.38 26.04,29.65 VCCC.2
  Top 0.813: D5.1 30.15,31.74 30.8,31.09 T3.2 30.8,30.09 29.21,28.51 27.94,28.51 27.3,28.51
  Bottom 0.406: R5.2 28.23,29.56 v28.19,29.52
5VC  (via drill 0.35)
  Top 0.254: v34.8,6.66 31.11,6.66 28.96,8.82 28.96,12.63 28.67,12.92 STM32F001.14
  Bottom 0.254: R16.1 32.6,4.46 v34.8,6.66
  Bottom 0.406: IC1.2 38.1,9.71 35.05,6.66 v34.8,6.66
5VC'  (via drill 0.35)
  Top 0.406: OP.1 37.47,11.99 37.12,11.65 RF1.2 37.12,9.33 37.63,8.82 v38.86,8.82
  Bottom 0.406: IC1.1 39.37,9.33 v38.86,8.82
5VC_OUT
  Top 0.406: RC1.2 37.25,17.73 C14.1 37.23,15.26 37.95,14.54 OP.3
5VC_OUT'
  Top 0.406: VCCC.7 26.04,22.66 26.54,22.16 33.66,22.16 34.54,21.27 37.93,21.27 RC1.1
!HIL!  (via drill 0.35)
  Top 0.406: R9.1 R10.1 15.66,38.88 v16.51,38.03 | v42.42,25.2 v40.89,25.2
  Bottom 0.406: IC2.13 38.1,28.51 37.78,28.19 | 37.78,28.19 37.59,28 36.83,28 | 36.83,28 34.29,25.46 | 34.29,25.46 33.66,25.46 33.02,24.82 IC2.6 | IC2.5 34.29,25.46 | IC2.12 36.83,28 | IC1.5 34.29,13.01 35.05,13.77 36.96,13.77 38.1,14.92 IC1.13 38.1,15.8 38.73,15.17 40.64,15.17 42.42,16.95 v42.42,25.2 42.42,34.22 41.15,35.49 35.56,35.49 33.02,38.03 v16.51,38.03 | 37.78,28.19 38.35,27.62 38.35,26.6 39.75,25.2 v40.89,25.2
BAT+
  Top 0.406: CR1201.+ 48.26,6.28
  Top 0.813: BACKUP.B 47.72,3.49 48.26,4.03 48.26,6.28 48.26,7.55
CAN_RX
  Top 0.254: STM32F001.45 17.33,13.92 16.54,13.13 16.54,5.18 15.88,4.52 MCP2562.4
CAN_TX
  Top 0.254: STM32F001.46 17.66,13.42 17.02,12.78 17.02,3 16.61,2.6 15.37,2.6 15.24,2.72 15.24,5.9 13.84,7.3 12.45,7.3 12.06,6.91 MCP2562.1
CANH1
  Top 0.508: MCP2562.7 13.34,9.82 13.89,10.38 13.89,12.82 11.81,14.9 11.81,21.65 10.16,23.3 5.51,23.3 U$2.7
CANL1
  Top 0.508: MCP2562.6 14.61,13.12 12.57,15.15 12.57,22.28 10.03,24.82 5.51,24.82 U$2.6
GND  (via drill 0.35, 0.5)
  Top 0.254: STM32F001.35 20.61,18.51 20.32,18.22 | 20.32,17.76 20.32,18.22 | STM32F001.47 20.19,12.92 | 20.19,12.92 20.61,12.92 22.86,15.17 | 22.86,15.17 20.45,17.58 20.45,17.63 20.32,17.76 | 23.61,14.42 STM32F001.8 23.61,9.97 23.62,9.96 23.62,9.06 23.51,8.95 C12.2 v23.88,8.82 | 23.61,14.42 22.86,15.17 | 19.16,11.47 19.06,11.47 19.81,12.22 19.81,12.54 20.19,12.92 | C7.2 19.18,18.74 19.34,18.74 19.86,18.22 | 20.32,18.22 19.86,18.22 | 19.86,18.22 20.32,17.76 | MCP2562.8 12.06,10.47 v13.08,11.49 | C11.2 28.82,18.43 27.8,17.42 STM32F001.23 26.2,17.42 | 26.2,17.42 25.94,17.42 25.94,14.32 v24.13,12.5 24.13,13.9 23.61,14.42 | 26.2,17.42 v25.65,17.96 v23.5,17.96
  Top 0.406: C3.2 R1.1 32.93,39.77 32.89,39.81 | C3.2 31.36,36 C4.2 33.15,34.86 33.53,34.47 v33.53,34.09 | C3.2 31.36,39.7 31.24,39.81 | C14.2 | C14.2 38.98,16.15 OP.4 | OP.4 | VCCC.5 23.5,24.44 C5.2 22.37,23.04 v23.5,23.04 | C13.2 35.81,7.69 37.11,7.69 RS1.1 | 33.89,7.57 34,7.68 35.29,7.68 C13.2 | 33.89,7.57 RS2.1 | C11.2 29.46,19.11 v29.97,19.61 29.97,18.98 31.24,17.71 C15.2 | 25.41,2.44 MICRO_USB.5 25.4,4.4 25.4,6.28 | 26.29,1.56 25.41,2.44 | 25.41,2.44 24.77,1.79 24.77,1.56 | C13.2 35.56,6.15 v35.18,5.77 | v32.89,8.82 32.89,8.57 33.89,7.57 | OP.4 40.01,15.8 40.26,15.55 | VDDC.5 17.14,23.55 v18.67,22.03 | 40.26,15.55 40.26,14.41 40.89,13.77 v41.66,13.77 42.8,13.77 v44.07,15.04 | C17.- 31.75,25.33 v31.88,25.2 | C14.2 39.5,17.71 40.39,16.82 40.39,15.68 40.26,15.55
  Top 0.508: C9.2 13.34,2.33 MCP2562.2 13.34,6.03 v13.72,6.41 | 13.1,0.69 12.84,0.95 | C9.2 12.84,0.95 | v18.8,6.53 19.43,7.17 19.43,11.11 19.06,11.47 C10.2 v18.41,10.85 | v15.62,13.14 v15.63,13.13 C8.2 | v18.92,19.61 C7.2 | C9.2 11.56,1.84 11.56,0.69 12.59,0.69 12.84,0.95
  Top 0.61: CHARGER.2 55.4,32.95 55.84,32.51 55.84,31.43 RPROG.1 54.19,25.42 54.28,25.33 C16.- | C6.2 29.48,24.45 30.35,25.33 C17.- | IC4.2 20.32,35.53 20.32,39.3 19.81,39.81 v17.78,39.81
  Top 0.813: IC4.2 v24.13,35.49 24.13,39.17 v24.77,39.81 31.24,39.81 32.89,39.81 v36.32,39.81 v38.1,39.81 | C16.- 54.61,25.33 52.25,22.97 CR1201.- 46.31,22.97 45.97,23.3 v44.07,23.3 43.56,23.81 38.91,23.81 IC3.1
  Top 1.016: U$2.8 10.16,20.25 v10.79,19.61 v10.79,15.8 | U$2.5 12.95,27.87 13.51,27.31 v13.51,21.98 v13.51,18.77 v13.51,17.32 13.51,15.53 15.62,13.42 v15.62,13.14 | MICRO_USB.GND1 24.77,1.56 26.29,1.56 MICRO_USB.GND2 27.84,1.98 29.84,3.99 32.13,3.99 32.92,3.2 POWER.A
  Bottom 0.406: R6.1 34.29,32.95 | 34.29,32.95 R8.1 | 34.29,32.95 33.53,33.71 v33.53,34.09 | v31.88,25.2 31.75,25.08 IC2.7 31.75,21.1 R4.1 30.27,19.61 v29.97,19.61 | v35.18,5.77 33.91,4.5 33.91,3.2 POWER.A | IC1.7 31.75,9.84 32.77,8.82 v32.89,8.82
  Bottom 0.508: 16.64,13.14 17.17,13.67 17.17,14.64 16,15.8 15.24,15.8 13.89,14.46 13.89,10.55 13.72,10.72 | 13.72,10.72 v13.72,6.41 13.84,6.28 18.54,6.28 v18.8,6.53 | 13.72,10.72 11.81,12.63 | 11.81,12.63 11.05,13.39 11.05,15.55 v10.79,15.8 | 11.05,19.36 v10.79,19.61 | 21.84,16.82 21.59,16.82 20.95,16.82 20.46,17.32 v13.51,17.32 13.33,17.32 12.57,16.57 12.57,13.39 11.81,12.63
  Bottom 0.813: v15.62,0.82 17.4,0.82 18.14,1.56 MICRO_USB.GND1 MICRO_USB.GND2 29.19,1.56 29.21,1.58 | v44.07,15.04 v44.07,19.11 v44.07,23.3 v44.07,31.81 44.07,34.86 41.91,37.01 36.96,37.01 36.32,37.65 v36.32,39.81 v38.1,39.81 45.48,39.81 LIPO.2 | v23.5,23.04 23.5,27.62 v17.78,33.33 16.89,34.22 15.11,34.22 14.1,33.2 14.1,32.57 15.62,31.05 15.62,24.09 v13.51,21.98 | 21.59,19.11 21.84,18.85 21.84,16.82 | 21.59,16.82 21.84,16.57 v21.84,14.66
  Bottom 1.016: v15.62,13.14 16.64,13.14 | 21.59,19.11 11.3,19.11 v10.79,19.61 v10.79,15.8 | v21.84,14.66 21.84,14.54 v20.32,13.01 20.32,13.14 20.57,13.14 20.57,13.01 19.62,12.06 | 19.62,12.06 v18.41,10.85 | 19.62,12.06 22.8,12.06 v23.11,12.38 | v13.51,21.98 13.56,22.03 v18.67,22.03
  other vias: 23.75,14.15 20.32,8.31 20.32,7.04 10.79,1.71 11.81,0.82 20.95,16.95 20.19,15.55 17.65,36.89 22.99,37.27 22.99,34.22 51.56,18.22 51.56,10.72 51.56,0.69 40.26,0.69 10.54,39.81 43.05,11.11 15.75,6.41 41.15,6.41
  pour Top: 19.68,17.96 19.68,13.14 26.04,13.14 26.04,17.96
  pour Top: 19.68,13.14 19.68,12.12 20.32,12.12 20.32,12.38 21.97,12.38 21.97,13.14
  pour Top: 22.86,13.14 22.73,13.14 22.73,12.5 22.73,11.99 26.04,11.99 26.04,13.14
  pour Bottom: 21.48,20.25 21.72,18.6 27.56,18.6 27.56,13.9 24.77,11.11 20.32,11.11 18.92,9.71 16.51,9.71 16.26,9.96 16.26,20.25
  pour Bottom: 16.26,13.77 16.13,13.65 15.88,13.65 15.49,13.65 15.37,13.65 15.11,13.39 15.11,13.01 15.11,12.88 16.26,11.74
  pour Bottom: 20.76,20.82 18.8,22.79 13.08,22.79 10.29,20 10.29,13.27 12.95,10.6 14.48,10.6 14.61,10.72 14.61,14.03 15.11,14.54 16.26,14.54 16.26,16.31
  pour Bottom: 13.21,5.9 22.99,5.9 24.26,7.17 24.26,9.07 23.75,9.58 20.83,9.58 18.03,6.79 15.75,6.79 14.22,8.31 14.22,11.23 13.21,11.23
  pour Top (no thermals): 16.89,2.09 16.89,0.31 14.86,0.31 14.86,2.09
  pour Top (no thermals): 19.94,12.12 19.81,11.99 19.81,10.22 20.95,9.07 20.95,0.06 16.64,0.06 16.64,0.95 18.03,2.34 18.03,7.8 19.05,8.82 19.05,11.99 19.18,12.12
  pour Top (no thermals): 14.99,-0.07 10.03,-0.07 10.03,2.22 11.94,2.22 12.19,1.96 12.19,1.2 14.99,1.2
  pour Top (no thermals): 21.21,17.58 21.21,17.84 21.72,18.34 26.04,18.34 26.04,17.84 21.46,17.84
  pour Top (no thermals): 13.84,15.8 13.84,15.93 13.84,25.2
  pour Bottom: 10.03,-0.07 10.03,2.22 24.26,2.22 24.26,-0.07
  pour Bottom: 10.16,15.17 10.16,36.76 12.7,39.3 25.4,39.3 27.94,36.76 27.94,18.98 12.7,18.98 11.43,17.71 11.43,15.17
  pour Bottom: 52.07,-0.07 52.07,5.01 52.07,40.57 43.18,40.57 43.18,8.82 38.1,8.82 36.83,8.82 33.02,5.01 33.02,3.74 29.21,3.74 27.94,2.47 24.13,2.47 24.13,-0.07
  pour Bottom: 43.18,16.44 42.29,15.55 42.29,14.28 41.4,14.28 39.37,12.25 39.37,8.19 43.18,8.19
  pour Bottom: 43.18,34.22 43.18,40.57 10.16,40.57 10.16,34.22 14.61,38.66 14.73,38.66 32.38,38.66 33.66,38.66 36.83,35.49 41.91,35.49
  pour Top: 20.32,5.01 20.32,-0.07 52.07,-0.07 52.07,5.01
  pour Top: 57.15,5.01 57.15,32.06 40.26,32.06 40.26,-0.07 52.07,-0.07 52.07,3.74 53.34,5.01
  pour Top: 10.16,2.47 17.78,2.47 17.78,17.71 19.05,18.98 19.05,22.79 17.78,24.06 17.14,24.06 17.27,24.19 17.27,26.47 12.06,31.68 10.16,31.68
  pour Top: 10.16,40.57 29.21,40.57 29.21,39.3 27.94,38.03 26.67,38.03 25.4,36.76 25.4,32.95 17.4,32.95 17.4,38.28 10.16,38.28
LIPO+
  Top 0.406: LIPO.1 46.98,38.29 43.95,38.29 42.62,39.63 D3.2 | CHARGER.3 54.61,33.93 54.61,34.09
  Top 0.813: LIPO.1 T2.2 50.5,37.71 51.44,36.77 51.44,36 52.32,35.11 54.23,35.11 54.61,34.73 54.61,34.09
N$1
  Top 0.61: RPROG.2 52.04,30.23 CHARGER.5
N$2  (via drill 0.35)
  Top 0.406: CHARGER.1 53.78,32 52.83,32.95 v50.8,32.95 | v40.13,5.52 R17.2
  Bottom 0.406: v50.8,32.95 48.26,30.41 48.26,21.52 46.99,20.25 46.99,7.68 44.83,5.52 v40.13,5.52
N$3
  Top 0.406: LED.C 19.04,1.33 19.04,3.47 19.43,3.87 20.83,3.87 21.59,4.63 RLED.1
N$5
  Top 0.406: OP.2 39.32,13.27 40.01,12.58 40.01,10.31 39.79,10.09 RF1.1 39.71,10.09 39.97,9.84 39.97,8.06 39.46,7.55 RS1.2
N$6
  Top 0.406: OP.6 31.17,14.54 30.23,13.59 30.23,10.94 31.08,10.09 RF2.1 RS2.2
N$9  (via drill 0.35)
  Top 0.406: T2.1 47.99,35 v48.01,34.98 | R3.1 37.85,34.22 37.2,34.87 T1.1 37.83,35.81 39.92,37.9 v40.01,37.9
  Bottom 0.406: v48.01,34.98 44.96,34.98 | 44.96,34.98 44.96,35.74 42.8,37.9 v40.01,37.9 | 44.96,34.98 44.96,14.66 43.81,13.52 43.81,9.58 42.8,8.57 40.26,8.57 34.92,3.23 POWER.C
N$10
  Top 0.406: R3.2 40.01,34.26 D4.1 D3.1
N$33
  Bottom 0.254: U$2.30 5.13,2.6 28.61,2.6 30.27,4.25 R16.2
N$34
  Bottom 0.254: U$2.29 10.16,5.01 10.41,4.76 10.41,4.75 12.06,3.11 27.85,3.11 30.9,6.15 R15.2
N$35
  Bottom 0.254: U$2.28 10.16,7.55 11.05,6.66 11.05,5.01 12.32,3.74 27.43,3.74 29.97,6.28 R14.2
N$36
  Bottom 0.254: U$2.27 10.16,10.09 11.68,8.57 11.68,5.26 12.57,4.38 26.92,4.38 28.96,6.41 28.96,10.89 29.97,11.91 R13.2
N$43
  Bottom 0.254: U$2.26 10.16,12.63 12.32,10.47 12.32,5.64 12.95,5.01 26.42,5.01 27.94,6.53 R12.2
N$44
  Bottom 0.254: U$2.25 10.16,15.17 10.41,14.92 10.41,13.14 12.95,10.6 12.95,5.9 13.21,5.64 25.91,5.64 26.92,6.66 26.92,11.27 R11.2
N$73
  Top 0.254: STM32F001.2 20.61,9.38 RLED.2
N$74  (via drill 0.35)
  Top 0.406: R9.2 12.45,37.18 11.94,37.69 v11.94,38.03
  Bottom 0.406: U$2.16 v11.94,38.03
N$75  (via drill 0.35)
  Top 0.254: v42.42,9.96 42.76,9.62 R18.2
  Bottom 0.254: U$2.17 10.41,35.49 13.59,38.66 33.66,38.66 36.2,36.12 41.53,36.12 43.18,34.47 43.18,16.19 42.42,15.42 v42.42,9.96
NRST1  (via drill 0.35)
  Top 0.254: v22.23,9.71 22.73,9.71 23.11,10.09 STM32F001.7 | U$2.15 11.18,2.47 11.43,2.72 11.43,7.3 11.94,7.8 15.11,7.8 v15.24,7.68
  Bottom 0.254: v22.23,9.71 22.1,9.84 20.83,9.84 18.16,7.17 15.75,7.17 v15.24,7.68
PVCC
  Bottom 0.406: R5.1 30.85,31.26 | 30.85,31.26 31.75,30.36 IC2.8 | R6.2 30.9,31.31 30.85,31.26
PVDD
  Bottom 0.406: R7.1 R8.2 36.41,32.9 35.56,32.05 IC2.11
PVPP
  Bottom 0.406: 35.56,22.54 35.56,21.27 36.41,20.42 R2.1 | 35.56,22.54 IC2.4 | R4.2 32.6,20.8 32.51,20.89 32.51,21.77 32.89,22.16 35.18,22.16 35.56,22.54
STAT
  Top 0.254: STM32F001.11 25.11,10 25.4,9.71 26.04,9.71 26.54,9.2 26.54,8.44 28.96,6.03 33.66,6.03 34.67,5.01 36.74,5.01 R17.1 38.27,6.53 40.04,6.53 R18.1
SVBU  (via drill 0.35)
  Top 0.254: v30.73,15.17 29.48,13.92 STM32F001.16
  Bottom 0.254: v30.73,15.17 30.99,14.92 30.99,11.32 R14.1
  Bottom 0.406: IC2.2 38.1,22.28 38.35,22.03 40.26,22.03 40.77,21.52 40.77,19.23 40.01,18.47 31.24,18.47 30.73,17.96 v30.73,15.17
SVCC  (via drill 0.35)
  Top 0.254: STM32F001.19 28.06,15.42 28.45,15.8 v28.45,16.44
  Bottom 0.254: v28.45,16.44 27.94,15.93 R11.1
  Bottom 0.406: IC2.9 33.02,28.25 31.75,26.98 30.61,26.98 29.59,25.96 29.59,22.66 28.45,21.52 v28.45,16.44
SVDD  (via drill 0.35)
  Top 0.254: STM32F001.18 28.58,14.92 29.21,15.55 v29.21,15.93
  Bottom 0.254: v29.21,15.93 28.96,15.68 28.96,11.7 27.94,10.69 R12.1
  Bottom 0.406: IC2.10 34.29,27.23 33.02,25.96 31.24,25.96 30.61,25.33 30.61,22.54 29.21,21.14 v29.21,15.93
SVPP  (via drill 0.35)
  Top 0.254: v29.97,15.55 29.97,15.36 29.04,14.42 STM32F001.17
  Bottom 0.254: v29.97,15.55 R13.1
  Bottom 0.406: IC2.3 36.83,22.03 37.59,21.27 39.75,21.27 40.01,21.01 40.01,19.61 39.62,19.23 30.73,19.23 29.97,18.47 v29.97,15.55
SWCLK1  (via drill 0.35)
  Top 0.254: v13.08,12.5 5.13,12.5 U$2.11 | v19.94,16.57 19.94,17.52 19.54,17.92 STM32F001.37
  Bottom 0.254: v19.94,16.57 19.81,16.69 13.59,16.69 13.21,16.31 13.21,12.63 v13.08,12.5
SWDIO1  (via drill 0.35)
  Top 0.254: v11.81,13.77 11.56,13.77 10.16,15.17 U$2.10 | STM32F001.34 21.11,18.12 v20.95,17.96
  Bottom 0.254: v11.81,13.77 11.81,16.69 13.08,17.96 v20.95,17.96
USB_5V  (via drill 0.5)
  Top 0.406: 37.24,37.71 T1.2 | MICRO_USB.1 22.81,7.37 22.86,7.42 | v38.23,38.66 38.23,38.61 37.32,37.71
  Top 0.61: D4.2 39.24,39.63 37.32,37.71 T1.2
  Top 0.813: v44.58,11.36 v44.58,10.09 44.58,6.53 42.29,4.25 34.29,4.25 33.4,5.14 28.57,5.14 26.04,7.68 23.11,7.68 22.86,7.42
  Bottom 0.813: v44.58,10.09 v44.58,11.36 45.97,12.76 45.97,31.55 49.02,34.6 49.02,35.36 48.39,36 46.1,36 43.31,38.79 38.35,38.79 v38.23,38.66
USB_D+  (via drill 0.35)
  Top 0.254: STM32F001.33 21.61,17.31 23.11,15.8 24.89,15.8 v25.15,15.55
  Top 0.406: MICRO_USB.3 24.11,6.01 v24.89,6.79
  Bottom 0.254: v25.15,15.55 25.4,15.8 25.53,15.8 25.91,15.42 25.91,7.55 25.15,6.79 v24.89,6.79
USB_D-  (via drill 0.35)
  Top 0.254: STM32F001.32 22.11,17.44 23.24,16.31 24.89,16.31 v25.15,16.57
  Top 0.406: v23.88,6.79 23.46,6.37 MICRO_USB.2
  Bottom 0.254: v23.88,6.79 24.51,6.15 25.15,6.15 26.42,7.42 26.42,15.55 25.65,16.31 25.4,16.31 v25.15,16.57
VBU  (via drill 0.35, 0.4, 0.5)
  Top 0.254: STM32F001.1 20.11,11.91 20.45,12.25 21.46,12.25 v22.35,13.14 | v19.68,22.28 19.05,22.92 19.05,27.62
  Top 0.406: BACKUP.C 45.72,18.98 41.91,22.79 v40.64,22.79 34.8,22.79 33.02,24.57 33.02,26.6 32,27.62 19.05,27.62 16,27.62 13.21,30.41 U$2.4
  Bottom 0.254: v22.35,13.14 22.73,13.52 22.73,19.36 21.97,20.12 20.32,20.12 19.68,20.76 v19.68,22.28
  Bottom 0.406: v40.64,22.79 39.37,22.79 IC2.1
VCC  (via drill 0.5)
  Top 0.406: LED.A 17.14,1.21 17.14,1.96 | v14.48,27.87 v14.47,27.88
  Top 0.508: MCP2562.3 14.61,1.85 C9.1 14.72,1.96 17.14,1.96 17.78,2.6 v17.78,7.93 | v16.35,14.22 16.26,14.22 14.47,16.01 v14.47,27.88
  Top 0.61: VCCC.4 23.5,28.51 24,28.51 24.77,29.27 VCCC.3
  Top 0.813: 24,28.51 16.64,28.51 v14.48,30.66 13.34,31.81 v12.7,31.81 | v12.06,34.22 v11.43,34.86 10.79,35.49 U$2.2 2.54,35.49
  Bottom 0.508: v17.78,7.93 16.13,7.93 14.61,9.46 14.61,13.77 15.05,14.22 v16.35,14.22
  Bottom 0.813: v14.48,27.87 v14.48,30.66 13.72,30.66 12.7,31.68 v12.7,31.81 12.06,32.44 v12.06,34.22 v11.43,34.86
VCC_GEN
  Top 0.813: IC3.3 37.02,24.7 36.39,25.33 C17.+ 34.74,28.59 35.23,29.07 D1.1 34.87,28.77 T3.3
VCC_USB
  Top 0.508: CHARGER.4 47.31,33.9 46.99,34.22 46.99,37.39 46.74,37.65 43.18,37.65 42.16,38.66 39.62,38.66 37.72,36.76 T1.3 D2.2
  Top 0.61: T3.1 32.7,30.82 33.24,30.28 35.81,30.28 36.2,30.66 36.2,32.27 T4.1 | T4.1 T1.3 35.2,38.05 34.63,38.61 R1.2 | T4.1 33.66,33.27 D5.2
VCCG_IN
  Top 0.813: I.2 38.99,29.77 38.43,29.21 D1.2 38.43,25.99 38.78,25.64 IC3.2
VDD  (via drill 0.35, 0.5)
  Top 0.254: STM32F001.36 20.11,20.38 19.74,20.74 C7.1 | STM32F001.9 24.13,11 24.13,9.96 24.51,9.58 24.51,9.57 C12.1 | STM32F001.48 17.82,12.42 17.53,12.12 17.53,10.47 18.27,9.72 C10.1 | STM32F001.24 27.01,19.05 C11.1
  Top 0.406: C5.1 | C5.1 21.29,24.93 VDDC.8 | VDDC.8 | C6.1 | VCCC.8 28.19,25.27 29.13,26.2 C6.1 | VCCC.8 | OP.8 35.05,11.99 35.56,11.49 | C13.1 35.56,11.49 | C5.1 22.23,26.35 22.61,26.73 v28.19,26.73 28.7,26.73 C6.1 | C11.1 v27.69,19.11 | v41.4,14.66 41.4,16.82 v40.51,17.71 40.51,21.39 39.88,22.03 34.67,22.03 33.4,23.3 27.43,23.3 27.3,23.43 VCCC.8 | 35.56,11.49 v35.56,12.63 | R10.2 v15.24,32.95
  Top 0.508: v18.41,9.07 C10.1 | v24.89,8.82 C12.1 | v15.62,11.23 v15.63,11.23 C8.1 15.88,10.28 MCP2562.5 | C7.1 19.45,21.27 20.7,21.27 v21.08,20.89
  Top 0.61: VDDC.4 17.14,32.19 18.03,32.19 18.41,31.81 VDDC.3
  Top 0.813: 17.14,32.19 v16,32.19 v15.24,32.95 U$2.3
  Bottom 0.406: IC1.14 39.37,17.61 39.47,17.71 v40.51,17.71 41.66,18.85 41.66,26.09 41.27,26.47 40.01,26.47 39.37,27.11 IC2.14 | v35.56,12.63 39.37,12.63 v41.4,14.66
  Bottom 0.61: IC2.14 39.37,31.05 39.75,31.43 40.89,31.43 41.53,32.06 41.53,33.71 40.51,34.73 35.18,34.73 33.15,36.76 28.45,36.76 28.07,36.38 28.07,31.43 27.18,30.54 27.18,27.74 v28.19,26.73
  Bottom 0.813: 22.73,20.89 v21.08,20.89 21.08,22.54 | 24.38,19.23 27.43,19.23 | 27.43,19.23 27.69,19.23 v27.69,19.11 | 27.43,19.23 27.43,25.96 v28.19,26.73 | 21.08,22.54 19.56,24.06 17.91,24.06 16.76,25.2 16.76,31.43 v16,32.19 v15.24,32.95 | 21.08,22.54 22.73,20.89 | 24.38,10.34 24.38,10.98 25.15,11.74 25.15,14.12 24,15.26 24,16.75 24.58,17.33 24.64,17.33 24.64,18.98 24.38,19.23 | 24.38,19.23 22.73,20.89
  Bottom 1.016: v24.89,8.82 24.89,9.84 24.38,10.34 24,10.72 20.45,10.72 18.8,9.07 v18.41,9.07 16.51,9.07 15.62,9.96 v15.62,11.23
VLIPO
  Top 0.813: T2.3 45.99,34.22 | 45.99,34.22 45.99,32.95 | 45.99,32.95 45.99,32.87 I.1 49.53,29.33 49.53,26.6 50.8,25.33 C16.+ | T4.3 37.83,32.95 44.72,32.95 | 44.72,32.95 45.99,32.95 | 45.99,34.22 44.72,32.95
VPP  (via drill 0.35, 0.5)
  Top 0.406: D2.1 30.02,34.95 30.11,34.86 | 27.69,33.24 IC4.1 | v33.27,21.39 25.65,21.39 24.51,22.54 v24.51,23.68
  Top 0.813: T4.2 34.22,31.37 33.78,31.81 32.13,31.81 31.75,32.19 31.75,33.6 30.75,34.6 C4.1 30.11,34.86 28.47,33.21 IC4.1 v26.3,33.21 v26.29,33.2 | U$2.1 10.16,38.03 12.7,35.49 v13.97,35.49
  Bottom 0.406: v24.51,23.68 24.51,32.95 24.77,33.2 v26.29,33.2 | v33.27,21.39 34.42,20.25 R2.2
  Bottom 0.813: v26.29,33.2 22.61,33.2 20.32,35.49 v13.97,35.49

### Text on the board
Bottom: WASA Rocket Project
tNames: USB & LiPo Power Module | Power | BackUp
bStop: WASA Rocket Project | Designed by @fujiy0, 2019